# EAGLE schematic eagle_logicanalyzer (EAGLE 4.16)
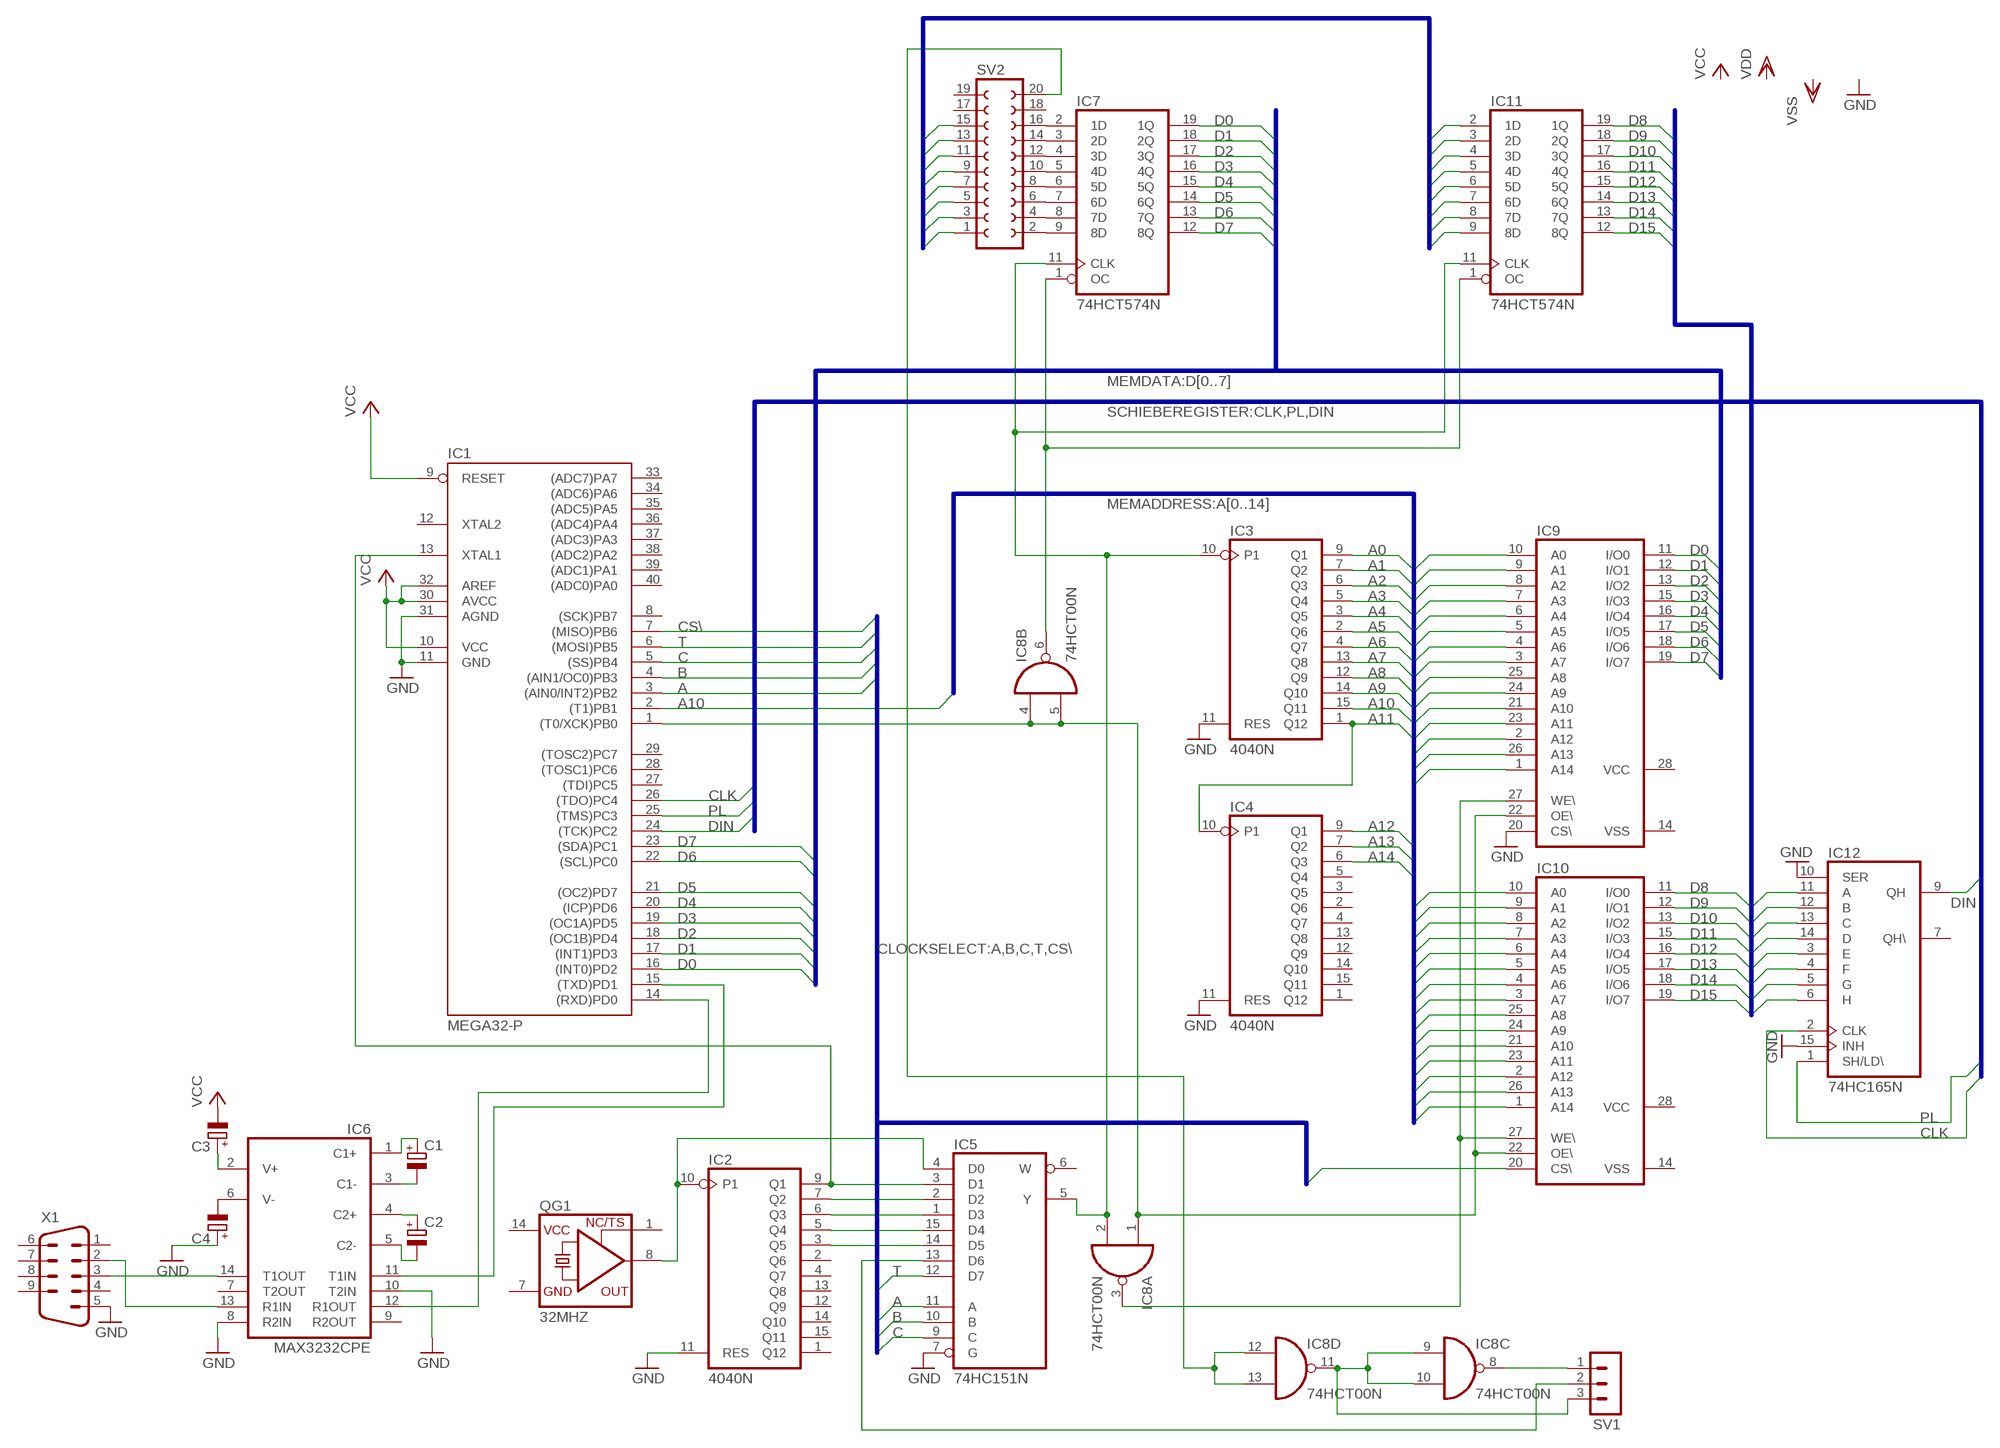
[diagram p0: schematic, sheet 1]

## Parts
C1  CPOL-EUE2,5-6E  [E2,5-6E]
C2  CPOL-EUE2,5-6E  [E2,5-6E]
C3  CPOL-EUE2,5-6E  [E2,5-6E]
C4  CPOL-EUE2,5-6E  [E2,5-6E]
IC1  MEGA32-P  [DIL40]
IC2  4040N  [DIL16]
IC3  4040N  [DIL16]
IC4  4040N  [DIL16]
IC5  74HC151N  [DIL16]
IC6  MAX3232CPE  [DIL16]
IC7  74HCT574N  [DIL20]
IC8  74HCT00N  [DIL14]
IC9  62832P  [DIL28-3]
IC10  62832P  [DIL28-3]
IC11  74HCT574N  [DIL20]
IC12  74HC165N  [DIL16]
QG1  32MHZ  XO-14  [DIL14S]
SV1  MA03-1  [MA03-1]
SV2  FE10-2  [FE10-2]
X1  M09H  [M09H]

## Nets
A: IC1.3((AIN0/INT2)PB2) IC5.11(A)
A0: IC3.9(Q1) IC9.10(A0) IC10.10(A0)
A1: IC3.7(Q2) IC9.9(A1) IC10.9(A1)
A2: IC3.6(Q3) IC9.8(A2) IC10.8(A2)
A3: IC3.5(Q4) IC9.7(A3) IC10.7(A3)
A4: IC3.3(Q5) IC9.6(A4) IC10.6(A4)
A5: IC3.2(Q6) IC9.5(A5) IC10.5(A5)
A6: IC3.4(Q7) IC9.4(A6) IC10.4(A6)
A7: IC3.13(Q8) IC9.3(A7) IC10.3(A7)
A8: IC3.12(Q9) IC9.25(A8) IC10.25(A8)
A9: IC3.14(Q10) IC9.24(A9) IC10.24(A9)
A10: IC1.2((T1)PB1) IC3.15(Q11) IC9.21(A10) IC10.21(A10)
A11: IC3.1(Q12) IC4.10(P1) IC9.23(A11) IC10.23(A11)
A12: IC4.9(Q1) IC9.2(A12) IC10.2(A12)
A13: IC4.7(Q2) IC9.26(A13) IC10.26(A13)
A14: IC4.6(Q3) IC9.1(A14) IC10.1(A14)
B: IC1.4((AIN1/OC0)PB3) IC5.10(B)
C: IC1.5((SS)PB4) IC5.9(C)
CLK: IC1.26((TDO)PC4) IC12.2(CLK)
CS\: IC1.7((MISO)PB6) IC10.20(CS\)
D0: IC1.16((INT0)PD2) IC7.19(1Q) IC9.11(I/O0)
D1: IC1.17((INT1)PD3) IC7.18(2Q) IC9.12(I/O1)
D2: IC1.18((OC1B)PD4) IC7.17(3Q) IC9.13(I/O2)
D3: IC1.19((OC1A)PD5) IC7.16(4Q) IC9.15(I/O3)
D4: IC1.20((ICP)PD6) IC7.15(5Q) IC9.16(I/O4)
D5: IC1.21((OC2)PD7) IC7.14(6Q) IC9.17(I/O5)
D6: IC1.22((SCL)PC0) IC7.13(7Q) IC9.18(I/O6)
D7: IC1.23((SDA)PC1) IC7.12(8Q) IC9.19(I/O7)
D8: IC10.11(I/O0) IC11.19(1Q) IC12.11(A)
D9: IC10.12(I/O1) IC11.18(2Q) IC12.12(B)
D10: IC10.13(I/O2) IC11.17(3Q) IC12.13(C)
D11: IC10.15(I/O3) IC11.16(4Q) IC12.14(D)
D12: IC10.16(I/O4) IC11.15(5Q) IC12.3(E)
D13: IC10.17(I/O5) IC11.14(6Q) IC12.4(F)
D14: IC10.18(I/O6) IC11.13(7Q) IC12.5(G)
D15: IC10.19(I/O7) IC11.12(8Q) IC12.6(H)
DIN: IC1.24((TCK)PC2) IC12.9(QH)
GND: C4.+ IC1.11(GND) IC1.31(AGND) IC2.11(RES) IC3.11(RES) IC4.11(RES) IC5.7(G) IC6.8(R2IN) IC6.10(T2IN) IC9.20(CS\) IC12.10(SER) IC12.15(INH) X1.5
INPUT8: IC11.2(1D) SV2.15
INPUT9: IC11.3(2D) SV2.13
INPUT10: IC11.4(3D) SV2.11
INPUT11: IC11.5(4D) SV2.9
INPUT12: IC11.6(5D) SV2.7
INPUT13: IC11.7(6D) SV2.5
INPUT14: IC11.8(7D) SV2.3
INPUT15: IC11.9(8D) SV2.1
N$1: IC2.10(P1) IC5.4(D0) QG1.8(OUT)
N$2: IC1.13(XTAL1) IC2.9(Q1) IC5.3(D1)
N$3: IC1.14((RXD)PD0) IC6.12(R1OUT)
N$4: IC1.15((TXD)PD1) IC6.11(T1IN)
N$5: IC2.7(Q2) IC5.2(D2)
N$6: IC2.6(Q3) IC5.1(D3)
N$7: IC2.5(Q4) IC5.15(D4)
N$8: IC2.3(Q5) IC5.14(D5)
N$9: IC3.10(P1) IC5.5(Y) IC7.11(CLK) IC8.2(A:I1) IC11.11(CLK)
N$10: IC8.9(C:I0) IC8.10(C:I1) IC8.11(D:O) SV1.3
N$11: IC7.9(8D) SV2.2
N$12: IC7.1(OC) IC8.6(B:O) IC11.1(OC)
N$13: IC1.1((T0/XCK)PB0) IC8.1(A:I0) IC8.4(B:I0) IC8.5(B:I1) IC9.22(OE\) IC10.22(OE\)
N$14: IC7.8(7D) SV2.4
N$15: IC8.3(A:O) IC9.27(WE\) IC10.27(WE\)
N$16: IC7.7(6D) SV2.6
N$17: IC7.6(5D) SV2.8
N$18: IC8.8(C:O) SV1.1
N$19: IC5.13(D6) SV1.2
N$20: IC7.5(4D) SV2.10
N$21: IC7.4(3D) SV2.12
N$22: IC7.3(2D) SV2.14
N$23: IC7.2(1D) SV2.16
N$24: IC8.12(D:I0) IC8.13(D:I1) SV2.20
N$25: IC6.14(T1OUT) X1.3
N$26: IC6.13(R1IN) X1.2
N$27: C3.+ IC6.2(V+)
N$28: C4.- IC6.6(V-)
N$29: C2.+ IC6.4(C2+)
N$30: C2.- IC6.5(C2-)
N$31: C1.- IC6.3(C1-)
N$32: C1.+ IC6.1(C1+)
PL: IC1.25((TMS)PC3) IC12.1(SH/LD\)
T: IC1.6((MOSI)PB5) IC5.12(D7)
VCC: C3.- IC1.9(RESET) IC1.10(VCC) IC1.30(AVCC) IC1.32(AREF)
Unconnected: IC1.8((SCK)PB7) IC1.12(XTAL2) IC1.27((TDI)PC5) IC1.28((TOSC1)PC6) IC1.29((TOSC2)PC7) IC1.33((ADC7)PA7) IC1.34((ADC6)PA6) IC1.35((ADC5)PA5) IC1.36((ADC4)PA4) IC1.37((ADC3)PA3) IC1.38((ADC2)PA2) IC1.39((ADC1)PA1) IC1.40((ADC0)PA0) IC2.1(Q12) IC2.2(Q6) IC2.4(Q7) IC2.12(Q9) IC2.13(Q8) IC2.14(Q10) IC2.15(Q11) IC4.1(Q12) IC4.2(Q6) IC4.3(Q5) IC4.4(Q7) IC4.5(Q4) IC4.12(Q9) IC4.13(Q8) IC4.14(Q10) IC4.15(Q11) IC5.6(W) IC6.7(T2OUT) IC6.9(R2OUT) IC12.7(QH\) QG1.1(TS) SV2.17 SV2.18 SV2.19 X1.1 X1.4 X1.6 X1.7 X1.8 X1.9

## Buses
MEMADDRESS:A[0..14]
CLOCKSELECT:A,B,C,T,CS\
MEMDATA:D[0..7]
MEMDATA:D[8..15]
INPUT[8..15]
SCHIEBEREGISTER:CLK,PL,DIN

## Power pins joined to a net without a drawn wire
GND: IC5.8(GND) IC6.15(GND) IC7.10(GND) IC8.7(P:GND) IC11.10(GND) IC12.8(GND) QG1.7(GND)
VCC: IC5.16(VCC) IC6.16(VCC) IC7.20(VCC) IC8.14(P:VCC) IC9.28(VCC) IC10.28(VCC) IC11.20(VCC) IC12.16(VCC) QG1.14(VCC)
VDD: IC2.16(VDD) IC3.16(VDD) IC4.16(VDD)
VSS: IC2.8(VSS) IC3.8(VSS) IC4.8(VSS) IC9.14(VSS) IC10.14(VSS)

## Library data of the parts
C1-C4 = rcl:CPOL-EU: POLARIZED CAPACITOR, European symbol
IC1 = atmel:MEGA32-P: MICROCONTROLLER 32 Kbytes FLASH 2 Kbytes SRAM 1 Kbytes EEPROM USART 8-channel 10 bit ADC Source: www.atmel.com .. doc2503.pdf
IC2-IC4 = 40xx:4040: 12-stage binary/ripple COUNTER
IC5 = 74xx-eu:74*151: Data SELECTOR/MULTIPLEXER
IC6 = maxim:MAX3232*: True RS-232 Transceivers 3.0V to 5.5V, Low-Power up to 1Mbps, Using Four 0.1µF External Capacitors Source: http://pdfserv.maxim-ic.com/en/ds/MAX3222-MAX3241.pdf
IC7 IC11 = 74xx-eu:74*574: 8-bit D type FLIP FLOP bus driver
IC8 = 74xx-eu:74*00: Quad 2-input NAND gate
IC9 IC10 = memory-hitachi:62832P: MEMORY
IC12 = 74xx-eu:74*165: 8-bit parallel load SHIFT REGISTER
QG1 = crystal:XO-: CRYSTAL
SV1 = con-lstb:MA03-1: PIN HEADER
SV2 = con-lsta:FE10-2: FEMALE HEADER
X1 = con-subd:M09: SUB-D